# EasyEDA Pro project ProDoc_PCB1_(6V)_2024-12-10.epro

# Board PCB1_(6V)
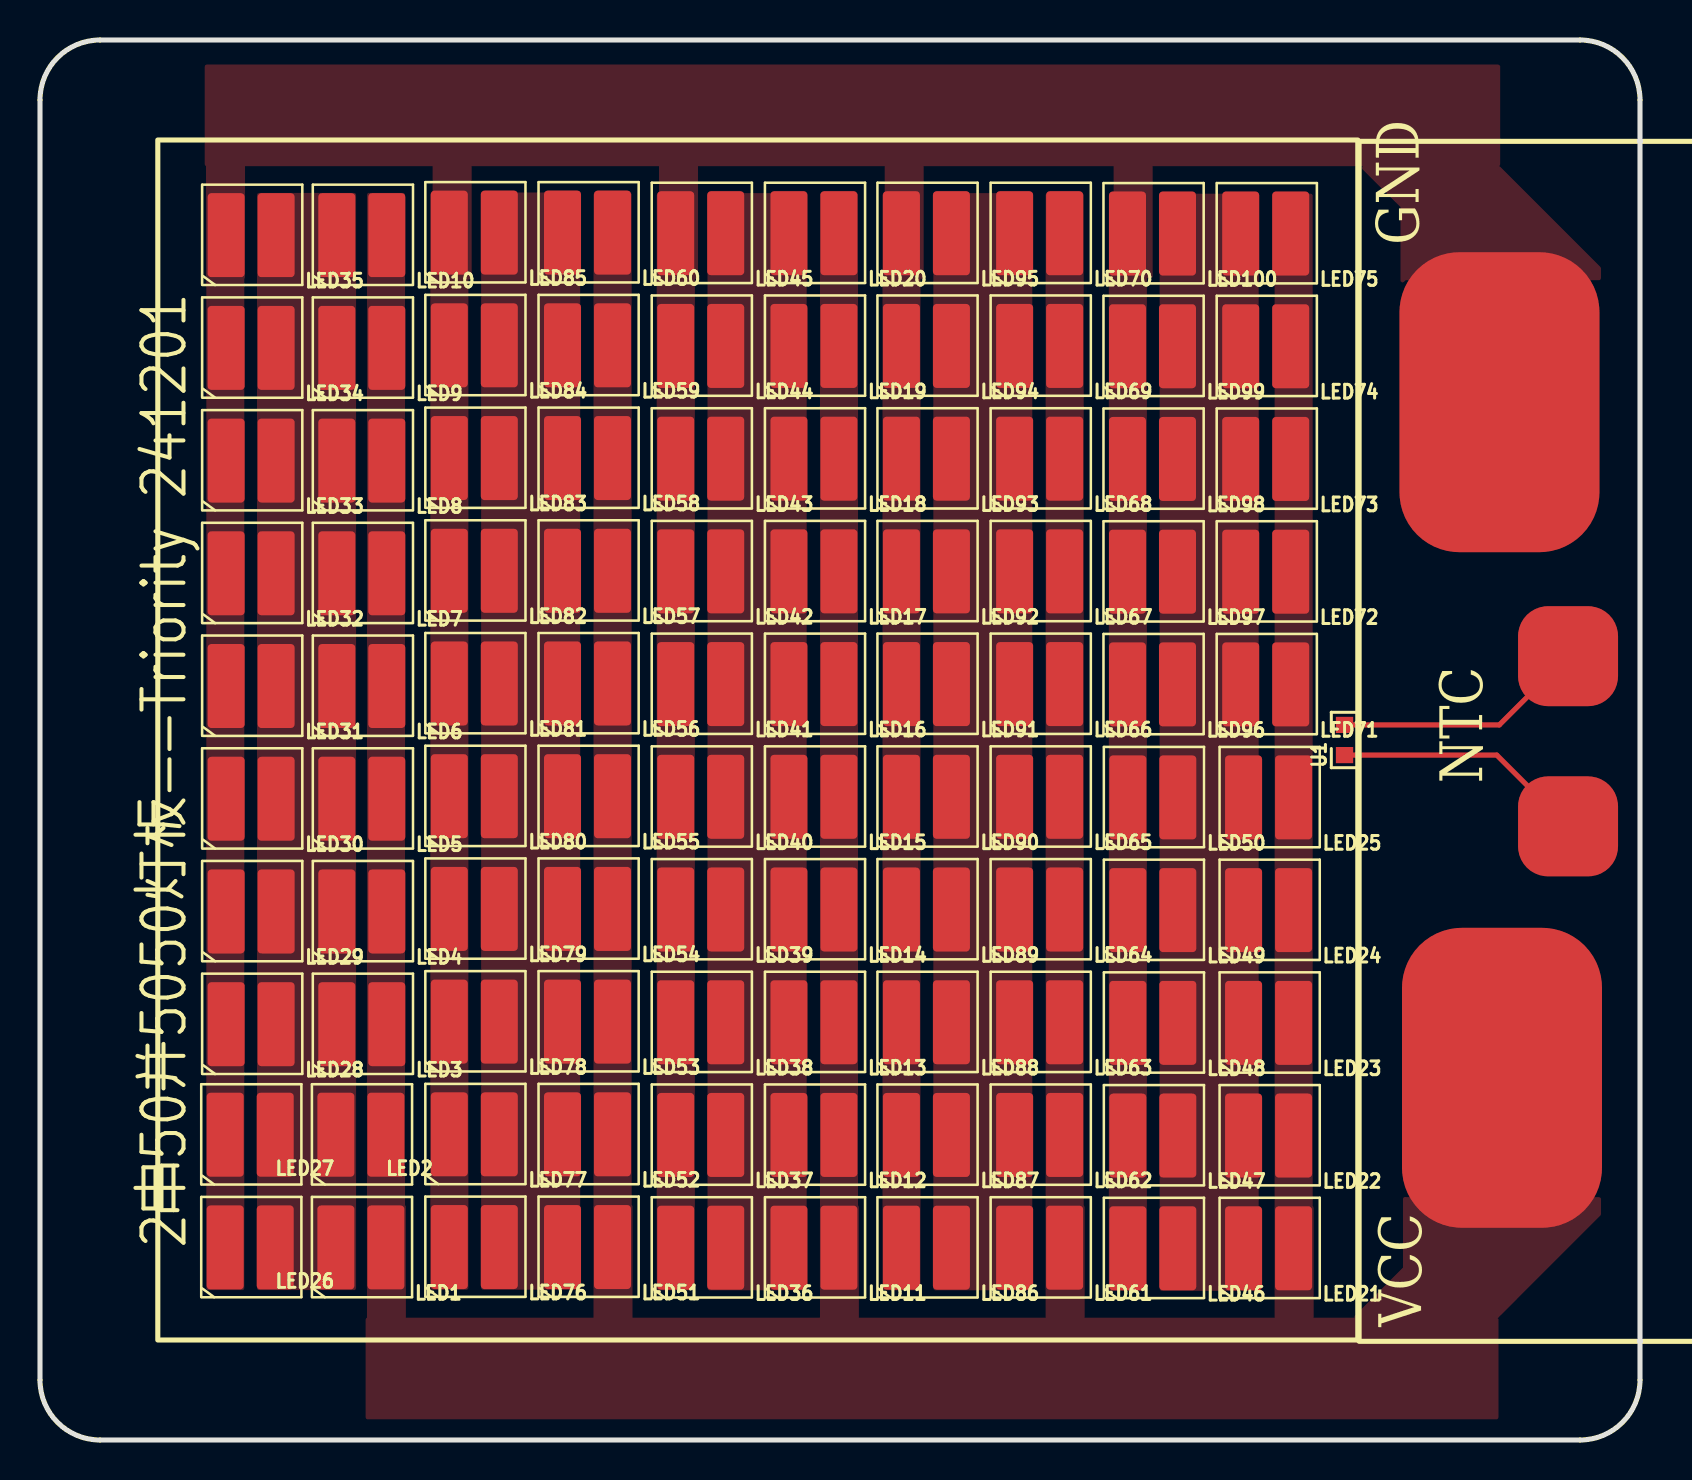
[diagram p0: board, top side]
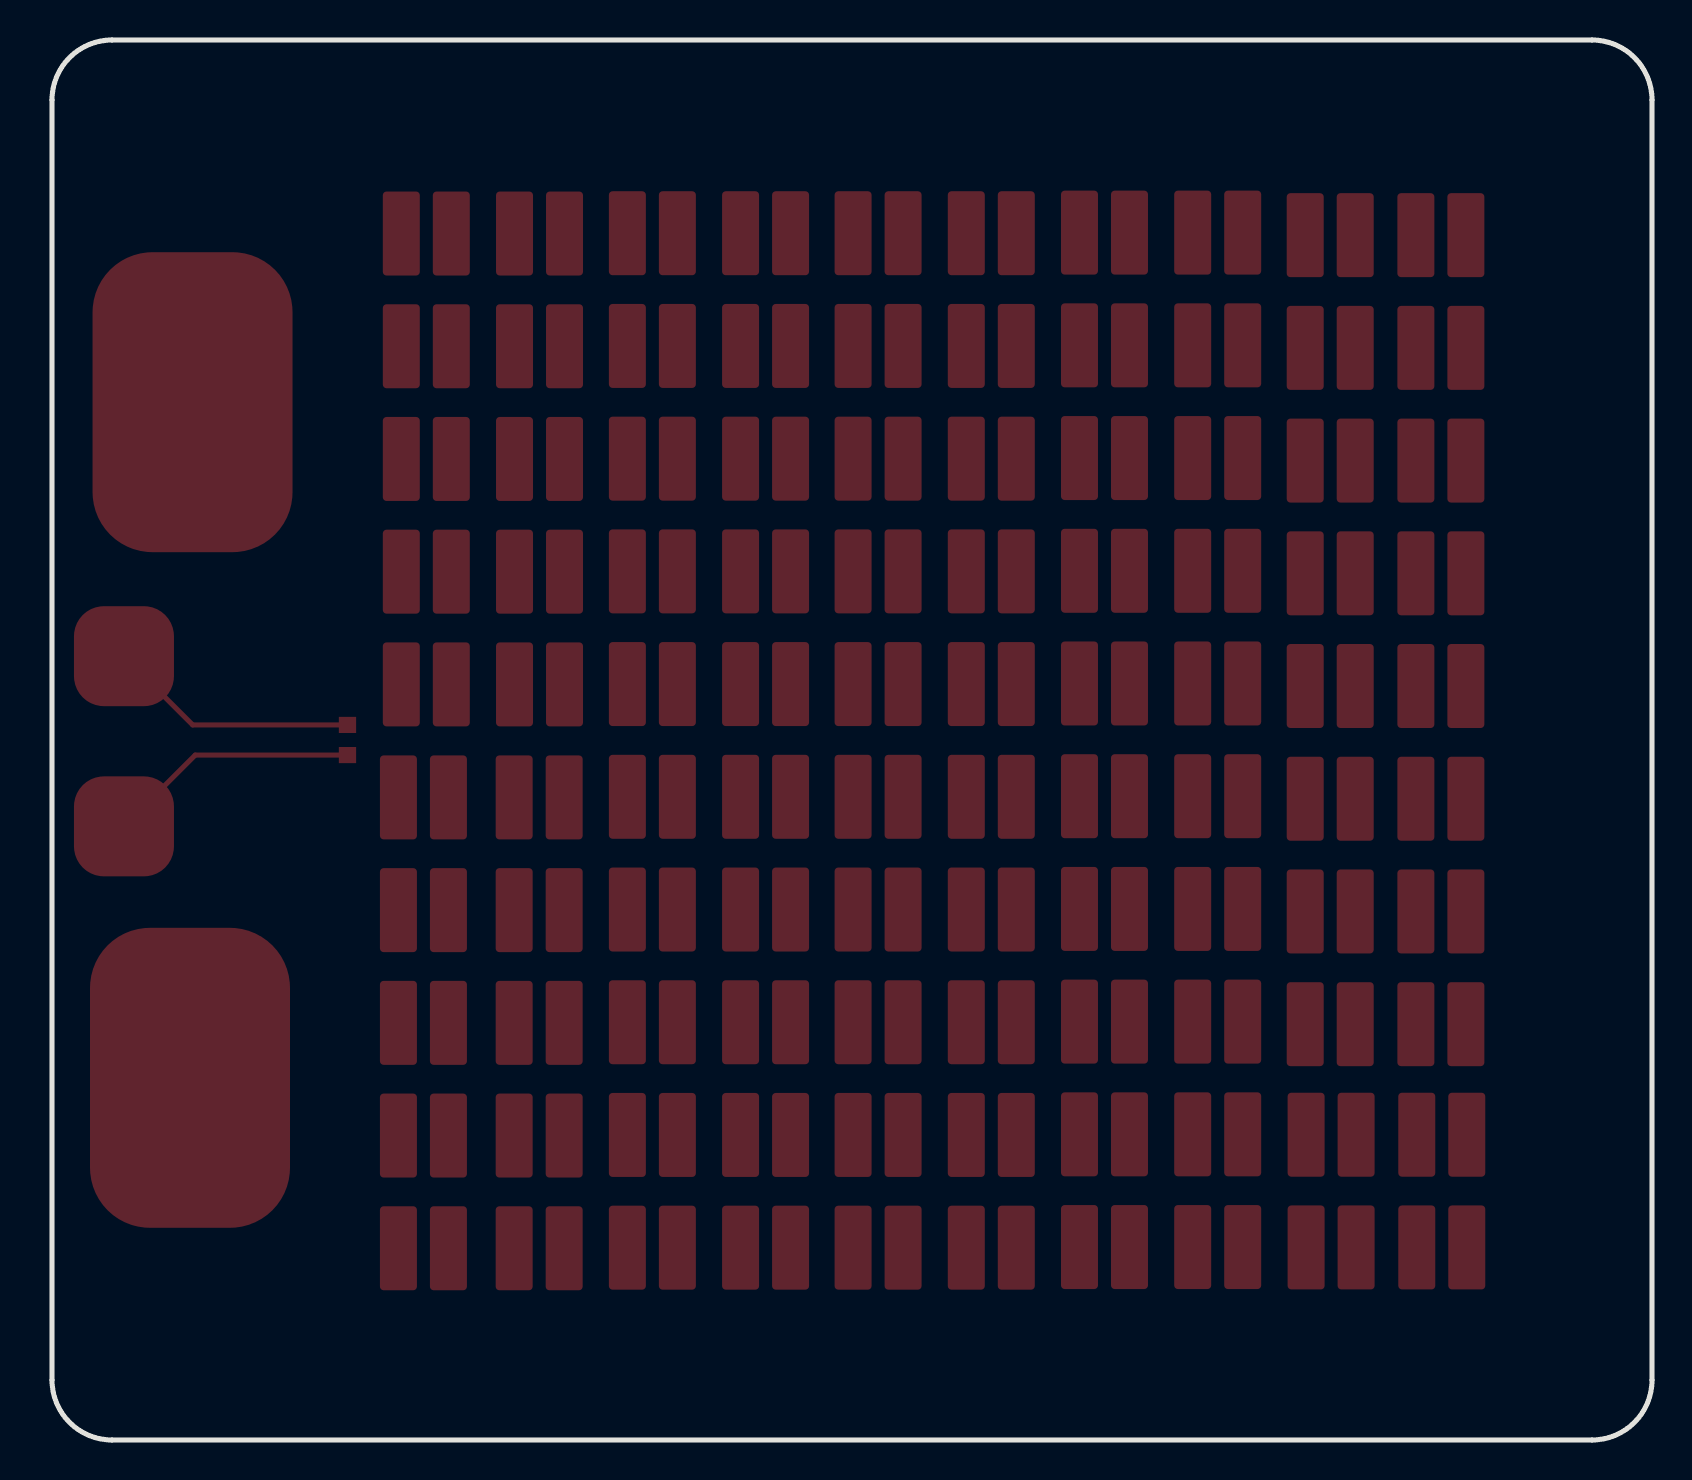
[diagram p1: board, bottom side, seen from below]

Outline 80 x 70 mm; copper layers: Top Layer, Bottom Layer. Coordinates in mm from the lower left corner of the outline.
Outline path: 0,67 0,3 arc(0.88,0.88) 3,0 77,0 arc(79.12,0.88) 80,3 80,67 arc(79.12,69.12) 77,70 3,70 arc(0.88,69.12) 0,67
Stack: Top Layer 0.035mm / Dielectric1 1.51mm FR4 er 4.5 / Bottom Layer 0.035mm

## Design rules (mm)
template: 自定义配置
spacing copperThickness1oz (default): track to track 0.102, other pairs 0.152 to 0.3
spacing copperThickness2oz: track to track 0.203, other pairs 0.152 to 0.3
track width copperThickness1oz (default): min 0.102, default 0.254, max 2.54
track width copperThickness2oz: min 0.203, default 0.254, max 2.54
differential pair differentialPair (default): width min 0.127, default 0.254, max 2.54; gap min 0.152, default 0.152
via viaSize (default): diameter min 0.5, default 1, max 10; hole min 0.3, default 0.5, max 6.3
net VCC uses copperRegion1
net $1N3279 uses copperRegion1
net GND uses copperRegion1

## Placement (name value [footprint] x y rotation side)
LED1  SAW9L60A  [emc5050-1]  16.04 9.63 180 top
LED2  SAW9L60A  [emc5050-1]  16.04 15.26 180 top
LED3  SAW9L60A  [emc5050-1]  16.09 20.79 180 top
LED4  SAW9L60A  [emc5050-1]  16.09 26.43 180 top
LED5  SAW9L60A  [emc5050-1]  16.09 32.06 180 top
LED6  SAW9L60A  [emc5050-1]  16.09 37.7 180 top
LED7  SAW9L60A  [emc5050-1]  16.09 43.33 180 top
LED8  SAW9L60A  [emc5050-1]  16.09 48.97 180 top
LED9  SAW9L60A  [emc5050-1]  16.09 54.61 180 top
LED10  SAW9L60A  [emc5050-1]  16.09 60.24 180 top
LED11  SAW9L60A  [emc5050-1]  38.7 9.62 180 top
LED12  SAW9L60A  [emc5050-1]  38.7 15.25 180 top
LED13  SAW9L60A  [emc5050-1]  38.7 20.89 180 top
LED14  SAW9L60A  [emc5050-1]  38.7 26.52 180 top
LED15  SAW9L60A  [emc5050-1]  38.7 32.16 180 top
LED16  SAW9L60A  [emc5050-1]  38.7 37.8 180 top
LED17  SAW9L60A  [emc5050-1]  38.7 43.43 180 top
LED18  SAW9L60A  [emc5050-1]  38.7 49.07 180 top
LED19  SAW9L60A  [emc5050-1]  38.7 54.7 180 top
LED20  SAW9L60A  [emc5050-1]  38.7 60.34 180 top
LED21  SAW9L60A  [emc5050-1]  61.43 9.59 180 top
LED22  SAW9L60A  [emc5050-1]  61.43 15.22 180 top
LED23  SAW9L60A  [emc5050-1]  61.43 20.86 180 top
LED24  SAW9L60A  [emc5050-1]  61.43 26.49 180 top
LED25  SAW9L60A  [emc5050-1]  61.43 32.13 180 top
LED26  SAW9L60A  [emc5050-1]  10.51 9.63 180 top
LED27  SAW9L60A  [emc5050-1]  10.51 15.26 180 top
LED28  SAW9L60A  [emc5050-1]  10.56 20.79 180 top
LED29  SAW9L60A  [emc5050-1]  10.56 26.43 180 top
LED30  SAW9L60A  [emc5050-1]  10.56 32.06 180 top
LED31  SAW9L60A  [emc5050-1]  10.56 37.7 180 top
LED32  SAW9L60A  [emc5050-1]  10.56 43.33 180 top
LED33  SAW9L60A  [emc5050-1]  10.56 48.97 180 top
LED34  SAW9L60A  [emc5050-1]  10.56 54.61 180 top
LED35  SAW9L60A  [emc5050-1]  10.56 60.24 180 top
LED36  SAW9L60A  [emc5050-1]  33.04 9.62 180 top
LED37  SAW9L60A  [emc5050-1]  33.04 15.25 180 top
LED38  SAW9L60A  [emc5050-1]  33.04 20.89 180 top
LED39  SAW9L60A  [emc5050-1]  33.04 26.52 180 top
LED40  SAW9L60A  [emc5050-1]  33.04 32.16 180 top
LED41  SAW9L60A  [emc5050-1]  33.04 37.8 180 top
LED42  SAW9L60A  [emc5050-1]  33.04 43.43 180 top
LED43  SAW9L60A  [emc5050-1]  33.04 49.07 180 top
LED44  SAW9L60A  [emc5050-1]  33.04 54.7 180 top
LED45  SAW9L60A  [emc5050-1]  33.04 60.34 180 top
LED46  SAW9L60A  [emc5050-1]  55.64 9.59 180 top
LED47  SAW9L60A  [emc5050-1]  55.64 15.22 180 top
LED48  SAW9L60A  [emc5050-1]  55.64 20.86 180 top
LED49  SAW9L60A  [emc5050-1]  55.64 26.49 180 top
LED50  SAW9L60A  [emc5050-1]  55.64 32.13 180 top
LED51  SAW9L60A  [emc5050-1]  27.38 9.65 180 top
LED52  SAW9L60A  [emc5050-1]  27.38 15.28 180 top
LED53  SAW9L60A  [emc5050-1]  27.38 20.92 180 top
LED54  SAW9L60A  [emc5050-1]  27.38 26.55 180 top
LED55  SAW9L60A  [emc5050-1]  27.38 32.19 180 top
LED56  SAW9L60A  [emc5050-1]  27.38 37.83 180 top
LED57  SAW9L60A  [emc5050-1]  27.38 43.46 180 top
LED58  SAW9L60A  [emc5050-1]  27.38 49.1 180 top
LED59  SAW9L60A  [emc5050-1]  27.38 54.73 180 top
LED60  SAW9L60A  [emc5050-1]  27.38 60.37 180 top
LED61  SAW9L60A  [emc5050-1]  49.98 9.62 180 top
LED62  SAW9L60A  [emc5050-1]  49.98 15.25 180 top
LED63  SAW9L60A  [emc5050-1]  49.98 20.89 180 top
LED64  SAW9L60A  [emc5050-1]  49.98 26.52 180 top
LED65  SAW9L60A  [emc5050-1]  49.98 32.16 180 top
LED66  SAW9L60A  [emc5050-1]  49.98 37.8 180 top
LED67  SAW9L60A  [emc5050-1]  49.98 43.43 180 top
LED68  SAW9L60A  [emc5050-1]  49.98 49.07 180 top
LED69  SAW9L60A  [emc5050-1]  49.98 54.7 180 top
LED70  SAW9L60A  [emc5050-1]  49.98 60.34 180 top
LED71  SAW9L60A  [emc5050-1]  61.28 37.78 180 top
LED72  SAW9L60A  [emc5050-1]  61.28 43.42 180 top
LED73  SAW9L60A  [emc5050-1]  61.28 49.05 180 top
LED74  SAW9L60A  [emc5050-1]  61.28 54.69 180 top
LED75  SAW9L60A  [emc5050-1]  61.28 60.32 180 top
LED76  SAW9L60A  [emc5050-1]  21.72 9.65 180 top
LED77  SAW9L60A  [emc5050-1]  21.72 15.28 180 top
LED78  SAW9L60A  [emc5050-1]  21.72 20.92 180 top
LED79  SAW9L60A  [emc5050-1]  21.72 26.55 180 top
LED80  SAW9L60A  [emc5050-1]  21.72 32.19 180 top
LED81  SAW9L60A  [emc5050-1]  21.72 37.83 180 top
LED82  SAW9L60A  [emc5050-1]  21.72 43.46 180 top
LED83  SAW9L60A  [emc5050-1]  21.72 49.1 180 top
LED84  SAW9L60A  [emc5050-1]  21.72 54.73 180 top
LED85  SAW9L60A  [emc5050-1]  21.72 60.37 180 top
LED86  SAW9L60A  [emc5050-1]  44.32 9.62 180 top
LED87  SAW9L60A  [emc5050-1]  44.32 15.25 180 top
LED88  SAW9L60A  [emc5050-1]  44.32 20.89 180 top
LED89  SAW9L60A  [emc5050-1]  44.32 26.52 180 top
LED90  SAW9L60A  [emc5050-1]  44.32 32.16 180 top
LED91  SAW9L60A  [emc5050-1]  44.32 37.8 180 top
LED92  SAW9L60A  [emc5050-1]  44.32 43.43 180 top
LED93  SAW9L60A  [emc5050-1]  44.32 49.07 180 top
LED94  SAW9L60A  [emc5050-1]  44.32 54.7 180 top
LED95  SAW9L60A  [emc5050-1]  44.32 60.34 180 top
LED96  SAW9L60A  [emc5050-1]  55.62 37.78 180 top
LED97  SAW9L60A  [emc5050-1]  55.62 43.42 180 top
LED98  SAW9L60A  [emc5050-1]  55.62 49.05 180 top
LED99  SAW9L60A  [emc5050-1]  55.62 54.69 180 top
LED100  SAW9L60A  [emc5050-1]  55.62 60.32 180 top
NOREF  -  [Pad_e265]  76.4 39.19 0 top
NOREF#2  -  [Pad_e197]  72.97 51.89 0 top
NOREF#3  -  [Pad_e196]  73.1 18.11 0 top
NOREF#4  -  [Pad_e264]  76.4 30.68 0 top
U1  B57355V5104F360  [R0603]  65.23 35 90 top

## Footprints (pads in the part's own frame, mm; a bottom-side part is the same pattern mirrored in y, then rotated)
emc5050-1
  rrect 1.85x4.2 smd: 1(-1.25,0) 2(1.25,0)
Pad_e196
  rrect 10x15 smd: 1(0,0)
Pad_e197
  rrect 10x15 smd: 1(0,0)
Pad_e264
  rrect 5x5 smd: 1(0,0)
Pad_e265
  rrect 5x5 smd: 1(0,0)
R0603
  rect 0.806x0.864 smd: 1(-0.753,0) 2(0.753,0)

## Nets
GND: LED26.2 LED27.2 LED28.2 LED29.2 LED30.2 LED31.2 LED32.2 LED33.2 LED34.2 LED35.2 LED36.2 LED37.2 LED38.2 LED39.2 LED40.2 LED41.2 LED42.2 LED43.2 LED44.2 LED45.2 LED46.2 LED47.2 LED48.2 LED49.2 LED50.2 LED76.2 LED77.2 LED78.2 LED79.2 LED80.2 LED81.2 LED82.2 LED83.2 LED84.2 LED85.2 LED86.2 LED87.2 LED88.2 LED89.2 LED90.2 LED91.2 LED92.2 LED93.2 LED94.2 LED95.2 LED96.2 LED97.2 LED98.2 LED99.2 LED100.2 NOREF#2.1
VCC: LED1.1 LED2.1 LED3.1 LED4.1 LED5.1 LED6.1 LED7.1 LED8.1 LED9.1 LED10.1 LED11.1 LED12.1 LED13.1 LED14.1 LED15.1 LED16.1 LED17.1 LED18.1 LED19.1 LED20.1 LED21.1 LED22.1 LED23.1 LED24.1 LED25.1 LED51.1 LED52.1 LED53.1 LED54.1 LED55.1 LED56.1 LED57.1 LED58.1 LED59.1 LED60.1 LED61.1 LED62.1 LED63.1 LED64.1 LED65.1 LED66.1 LED67.1 LED68.1 LED69.1 LED70.1 LED71.1 LED72.1 LED73.1 LED74.1 LED75.1 NOREF#3.1
FBVHD: NOREF.1 U1.2
RZBDR: NOREF#4.1 U1.1
$1N3279: LED1.2 LED2.2 LED3.2 LED4.2 LED5.2 LED6.2 LED7.2 LED8.2 LED9.2 LED10.2 LED11.2 LED12.2 LED13.2 LED14.2 LED15.2 LED16.2 LED17.2 LED18.2 LED19.2 LED20.2 LED21.2 LED22.2 LED23.2 LED24.2 LED25.2 LED26.1 LED27.1 LED28.1 LED29.1 LED30.1 LED31.1 LED32.1 LED33.1 LED34.1 LED35.1 LED36.1 LED37.1 LED38.1 LED39.1 LED40.1 LED41.1 LED42.1 LED43.1 LED44.1 LED45.1 LED46.1 LED47.1 LED48.1 LED49.1 LED50.1 LED51.2 LED52.2 LED53.2 LED54.2 LED55.2 LED56.2 LED57.2 LED58.2 LED59.2 LED60.2 LED61.2 LED62.2 LED63.2 LED64.2 LED65.2 LED66.2 LED67.2 LED68.2 LED69.2 LED70.2 LED71.2 LED72.2 LED73.2 LED74.2 LED75.2 LED76.1 LED77.1 LED78.1 LED79.1 LED80.1 LED81.1 LED82.1 LED83.1 LED84.1 LED85.1 LED86.1 LED87.1 LED88.1 LED89.1 LED90.1 LED91.1 LED92.1 LED93.1 LED94.1 LED95.1 LED96.1 LED97.1 LED98.1 LED99.1 LED100.1

## Routing (per net, layer and track width the routed paths; a pad name or vN(x,y) marks a point on that pad's centre or on a via; arc(x,y) is an arc through that point)
FBVHD: length 12.6
  Top Layer w0.254: NOREF.1 72.96,35.75 U1.2
RZBDR: length 12.7
  Top Layer w0.254: U1.1 72.84,34.25 NOREF#4.1

## Copper pours and planes (outline as drawn; the poured copper is in the pictures)
GND on Top Layer: 30.95,58.1 30.95,64.65 30.81,64.79 32.9,64.79 32.9,58.12 32.84,58.06 30.99,58.06
GND on Top Layer: 8.24,68.77 8.24,63.69 73.01,63.69 73.01,68.77
GND on Top Layer: 42.24,58.1 42.24,64.65 42.1,64.79 44.19,64.79 44.19,58.12 44.13,58.06 42.28,58.06
GND on Top Layer: 21.42,7.51 21.42,62.38 19.52,62.38 19.52,7.51
GND on Top Layer: 32.74,7.48 32.74,62.35 30.84,62.35 30.84,7.48
GND on Top Layer: 53.68,58.13 53.68,64.68 53.54,64.82 55.63,64.82 55.63,58.15 55.57,58.09 53.72,58.09
GND on Top Layer: 19.63,58.07 19.63,64.62 19.49,64.76 21.58,64.76 21.58,58.09 21.52,58.03 19.67,58.03
GND on Top Layer: 8.3,58.09 8.3,64.64 8.16,64.78 10.25,64.78 10.25,58.11 10.19,58.05 8.34,58.05
GND on Top Layer: 78.05,58.62 78.05,57.99 68.27,57.99 68.02,57.73 68.02,61.64 65.95,63.71 72.97,63.71
GND on Top Layer: 55.35,7.45 55.35,62.32 53.44,62.32 53.44,7.45
GND on Top Layer: 10.22,7.5 10.22,62.36 8.31,62.36 8.31,7.5
GND on Top Layer: 44.03,7.48 44.03,62.35 42.12,62.35 42.12,7.48
VCC on Top Layer: 39,11.71 39,5.16 38.86,5.02 40.95,5.02 40.95,11.69 40.89,11.75 39.04,11.75
VCC on Top Layer: 16.35,11.72 16.35,5.17 16.2,5.03 18.3,5.03 18.3,11.7 18.24,11.76 16.39,11.76
VCC on Top Layer: 40.9,7.48 40.9,62.35 39,62.35 39,7.48
VCC on Top Layer: 16.28,1.03 16.28,6.12 72.93,6.12 72.93,1.03
VCC on Top Layer: 29.58,7.51 29.58,62.38 27.68,62.38 27.68,7.51
VCC on Top Layer: 63.64,7.45 63.64,62.32 61.73,62.32 61.73,7.45
VCC on Top Layer: 52.19,7.48 52.19,62.35 50.28,62.35 50.28,7.48
VCC on Top Layer: 61.73,11.68 61.73,5.13 61.59,4.99 63.68,4.99 63.68,11.66 63.62,11.72 61.77,11.72
VCC on Top Layer: 50.28,11.71 50.28,5.16 50.14,5.02 52.23,5.02 52.23,11.69 52.17,11.75 50.32,11.75
VCC on Top Layer: 18.25,7.5 18.25,62.36 16.35,62.36 16.35,7.5
VCC on Top Layer: 27.68,11.74 27.68,5.19 27.53,5.05 29.63,5.05 29.63,11.72 29.57,11.78 27.72,11.78
VCC on Top Layer: 78.05,11.26 78.05,12.15 68.27,12.15 68.15,12.27 68.15,8.62 65.57,6.04 72.84,6.04
$1N3279 on Top Layer: 44.66,7.48 49.62,7.48 49.62,62.35 44.66,62.35
$1N3279 on Top Layer: 55.98,7.45 60.94,7.45 60.94,62.32 55.98,62.32
$1N3279 on Top Layer: 10.85,7.5 15.81,7.5 15.81,62.36 10.85,62.36
$1N3279 on Top Layer: 22.06,7.51 27.01,7.51 27.01,62.38 22.06,62.38
$1N3279 on Top Layer: 33.38,7.48 38.33,7.48 38.33,62.35 33.38,62.35

## Text on the board
Top Silkscreen Layer: 2串50并5050灯板——Triority 241201 | GND | VCC | NTC
